# Altium schematic sheet GSB-S06-V00-I2CMicrofit.SchDoc
size A4
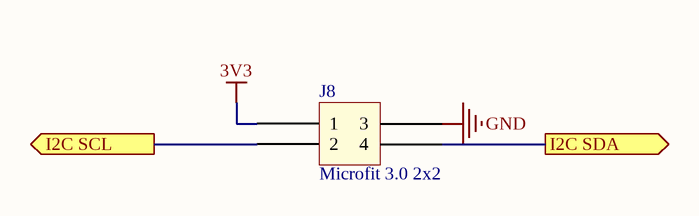
[diagram p0: GSB-S06-V00-I2CMicrofit.SchDoc]

## Parts
J8  Microfit 3.0 2x2  [Microfit_2X2_R_TH]

## Ports
I2C SCL (out), I2C SDA (out)

## Nets
3V3: J8.1
GND: J8.3
I2C SCL: J8.2 ; port I2C SCL
I2C SDA: J8.4 ; port I2C SDA

## Library data of the parts
J8 = Microfit_2x2